# EasyEDA schematic 6coils-1.json
TITLE: Sheet_1; REV: 1.0; Date: 2023-10-23; Sheet: 1/1; Company: Your Company
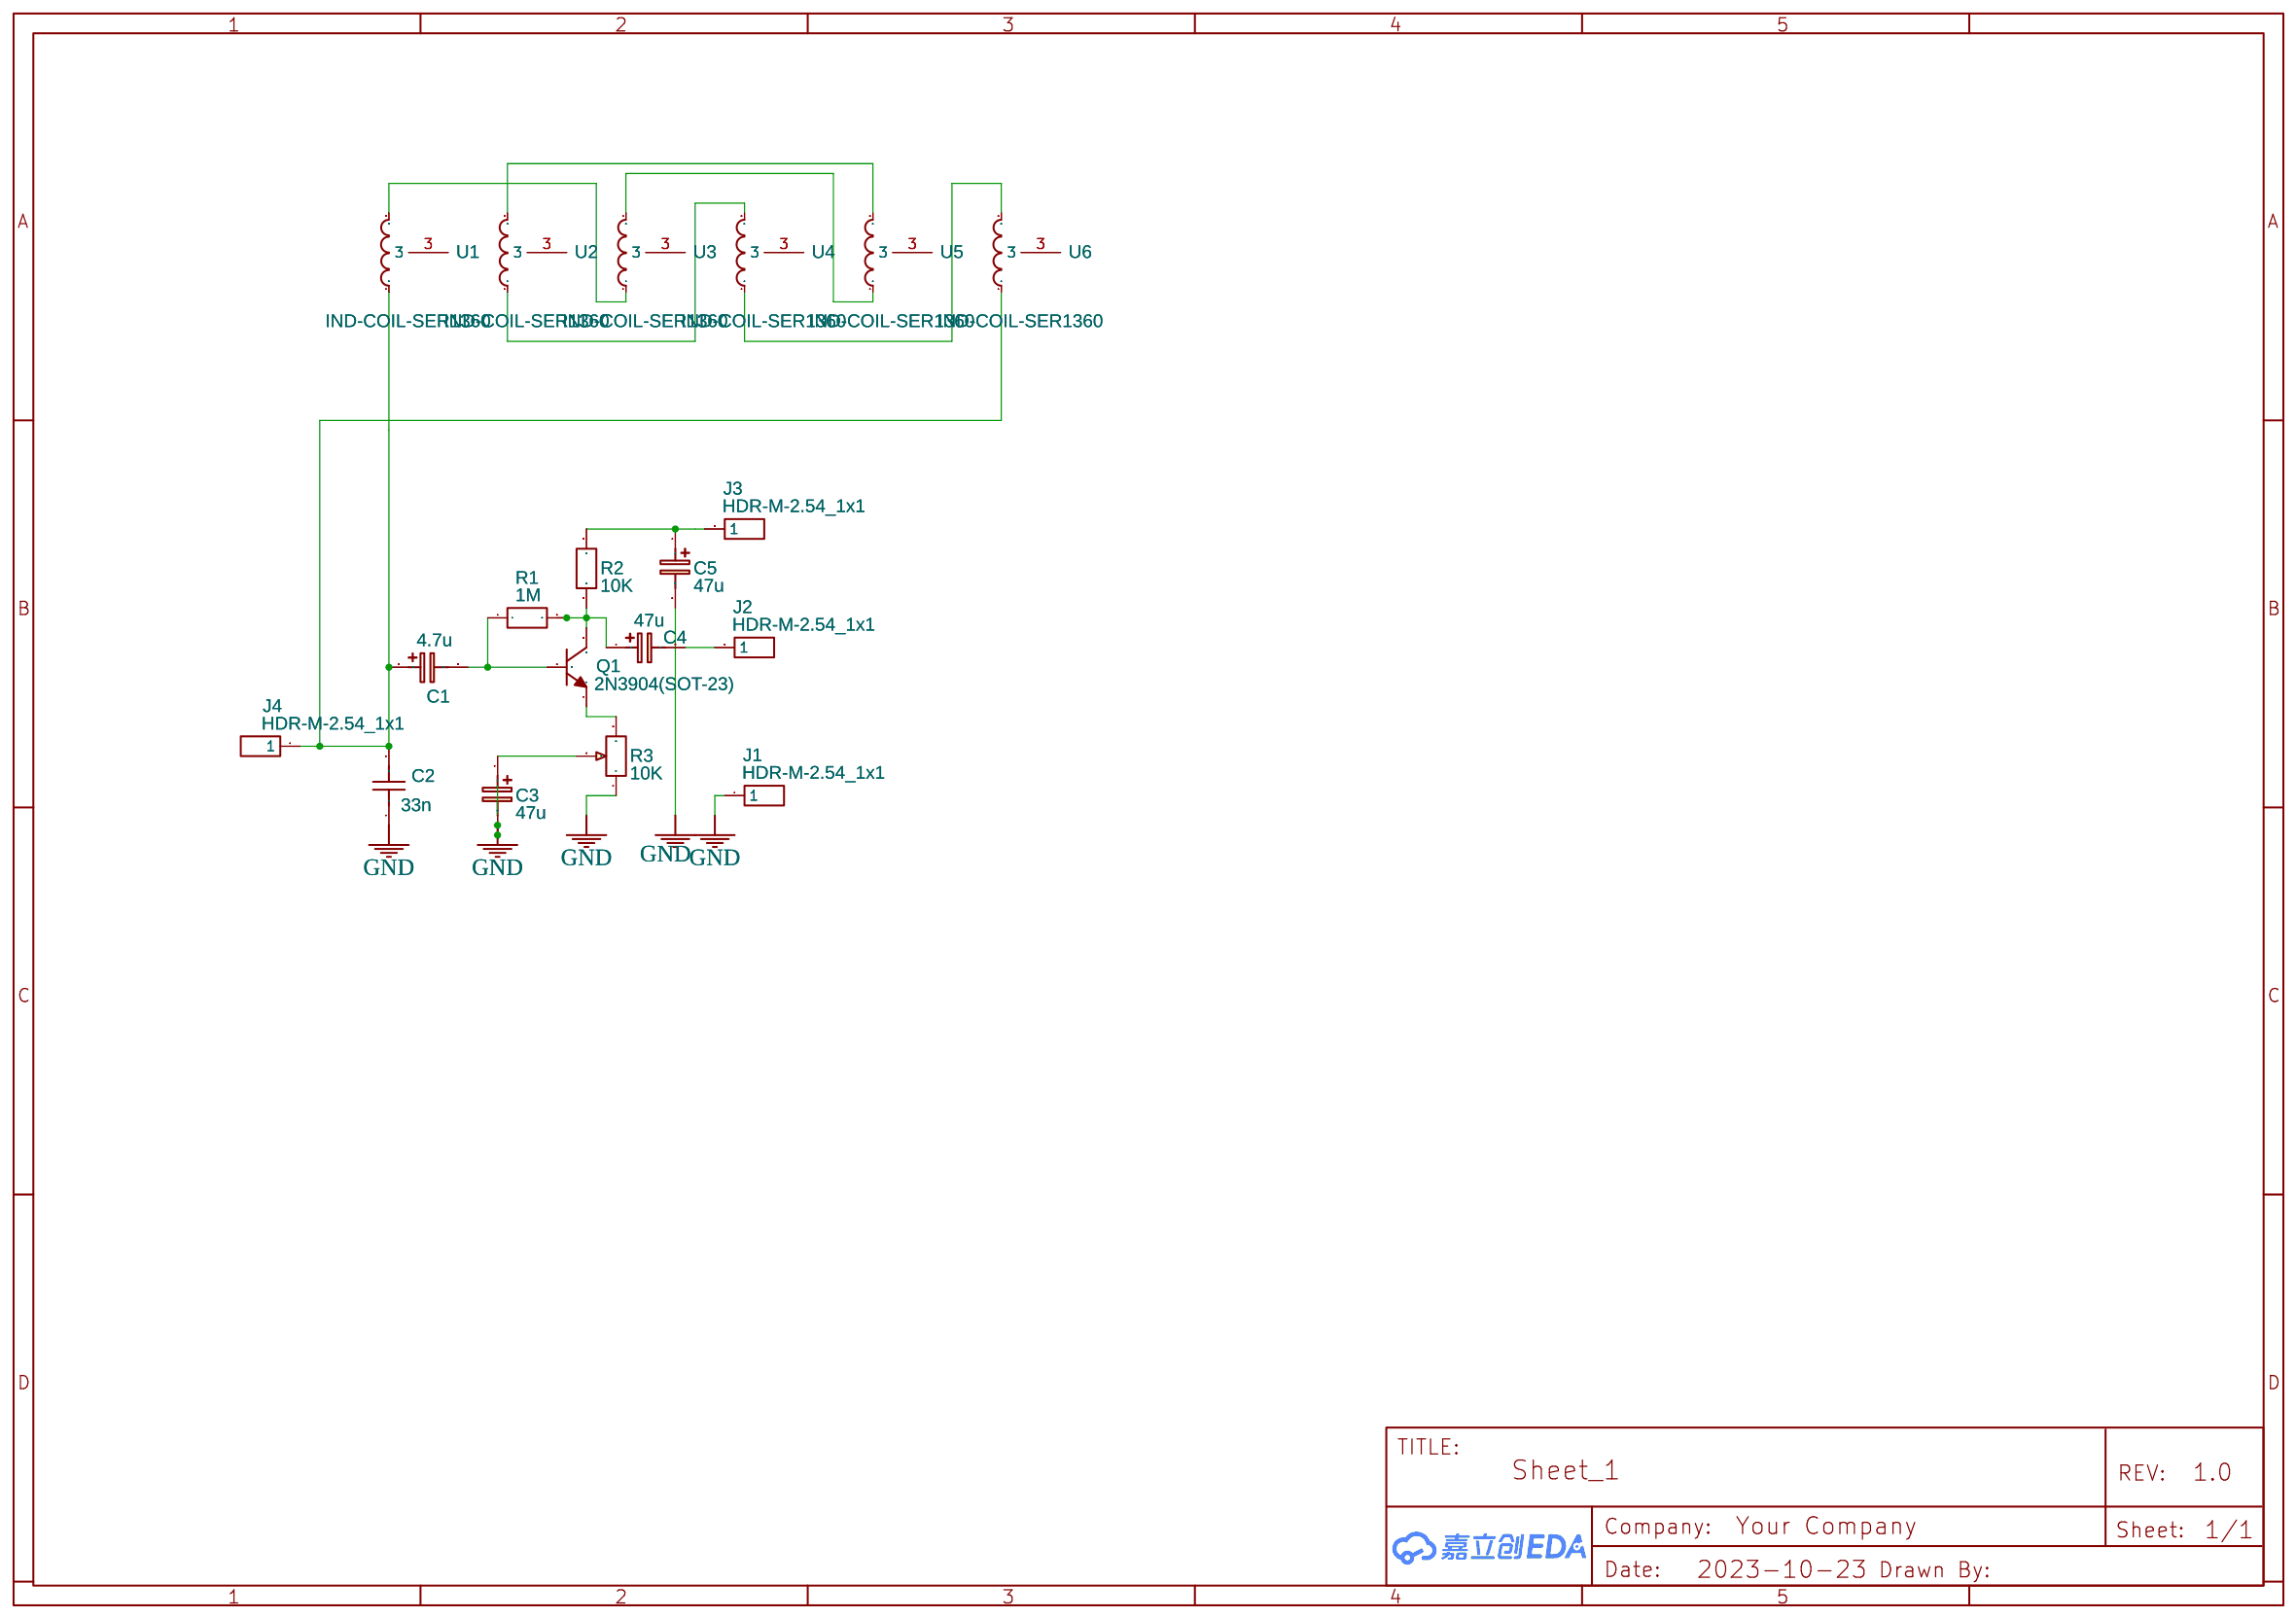
[diagram p0: schematic sheet]

## Parts
C1  4.7u  [CASE-A_3216]
C2  33n  [C0603]
C3  47u  [CASE-A_3216]
C4  47u  [CASE-A_3216]
C5  47u  [CASE-A_3216]
J1  HDR-M-2.54_1x1  [HDR-M-2.54_1X1]
J2  HDR-M-2.54_1x1  [HDR-M-2.54_1X1]
J3  HDR-M-2.54_1x1  [HDR-M-2.54_1X1]
J4  HDR-M-2.54_1x1  [HDR-M-2.54_1X1]
Q1  2N3904(SOT-23)  [SOT-23-3_L2.9-W1.3-P1.90-LS2.4-TR]
R1  1M  [R0603]
R2  10K  [R0603]
R3  10K  [RES-ADJ-TH_RM063-103]
U1  IND-COIL-SER1360  [IND-SMD_3P-L14.5-W14.5]
U2  IND-COIL-SER1360  [IND-SMD_3P-L14.5-W14.5]
U3  IND-COIL-SER1360  [IND-SMD_3P-L14.5-W14.5]
U4  IND-COIL-SER1360  [IND-SMD_3P-L14.5-W14.5]
U5  IND-COIL-SER1360  [IND-SMD_3P-L14.5-W14.5]
U6  IND-COIL-SER1360  [IND-SMD_3P-L14.5-W14.5]

## Library data of the parts
C1 C3-C5 = C_Tan_SMD_A_EU: Contributor: LCEDA_Lib
C2 = C_0603_US: Contributor: LCEDA_Lib
J1-J4 = HDR-M-2.54_1x1: Supplier Part: C81276; Supplier: LCSC; Contributor: LCEDA_Lib
Q1 = 2N3904(SOT-23): Supplier: LCSC; Manufacturer: KEC; Manufacturer Part: 2n3904S-RTK/PS; Supplier Part: C18536; Paste Type: SOT-23; Contributor: LCEDA_Lib
R1 R2 = R_0603_EU: Contributor: LCEDA_Lib
R3 = RM063-103 10K: Supplier: LCSC; Manufacturer: JML; Supplier Part: C38793
U1-U6 = IND-COIL-SER1360: Contributor: LCSC; Supplier: LCSC; Supplier Part: C2920778; Manufacturer: null; JLCPCB Part Class: Extended Part

## Nets
GND: C2.1 C3.2 C5.2 J1.1 R3.1
Net-(C1-1): C1.1 C2.2 J4.1 U1.1 U6.1
Net-(C1-2): C1.2 Q1.2(B) R1.1
Net-(C3-1): C3.1 R3.2
Net-(C4-1): C4.1 Q1.3(C) R1.2 R2.1
Net-(C4-2): C4.2 J2.1
Net-(C5-1): C5.1 J3.1 R2.2
Net-(Q1-1): Q1.1(E) R3.3
Net-(U1-2): U1.2 U3.1
Net-(U2-1): U2.1 U4.2
Net-(U2-2): U2.2 U5.2
Net-(U3-2): U3.2 U5.1
Net-(U4-1): U4.1 U6.2

Not connected (* = marked no-connect by the designer): U1 3; U2 3; U3 3; U4 3; U5 3; U6 3
